# EasyEDA schematic SCH_Capstone_2024-02-12.json
TITLE: Sheet_1; REV: 1.0; Date: 2024-02-11; Sheet: 1/1; Company: Your Company
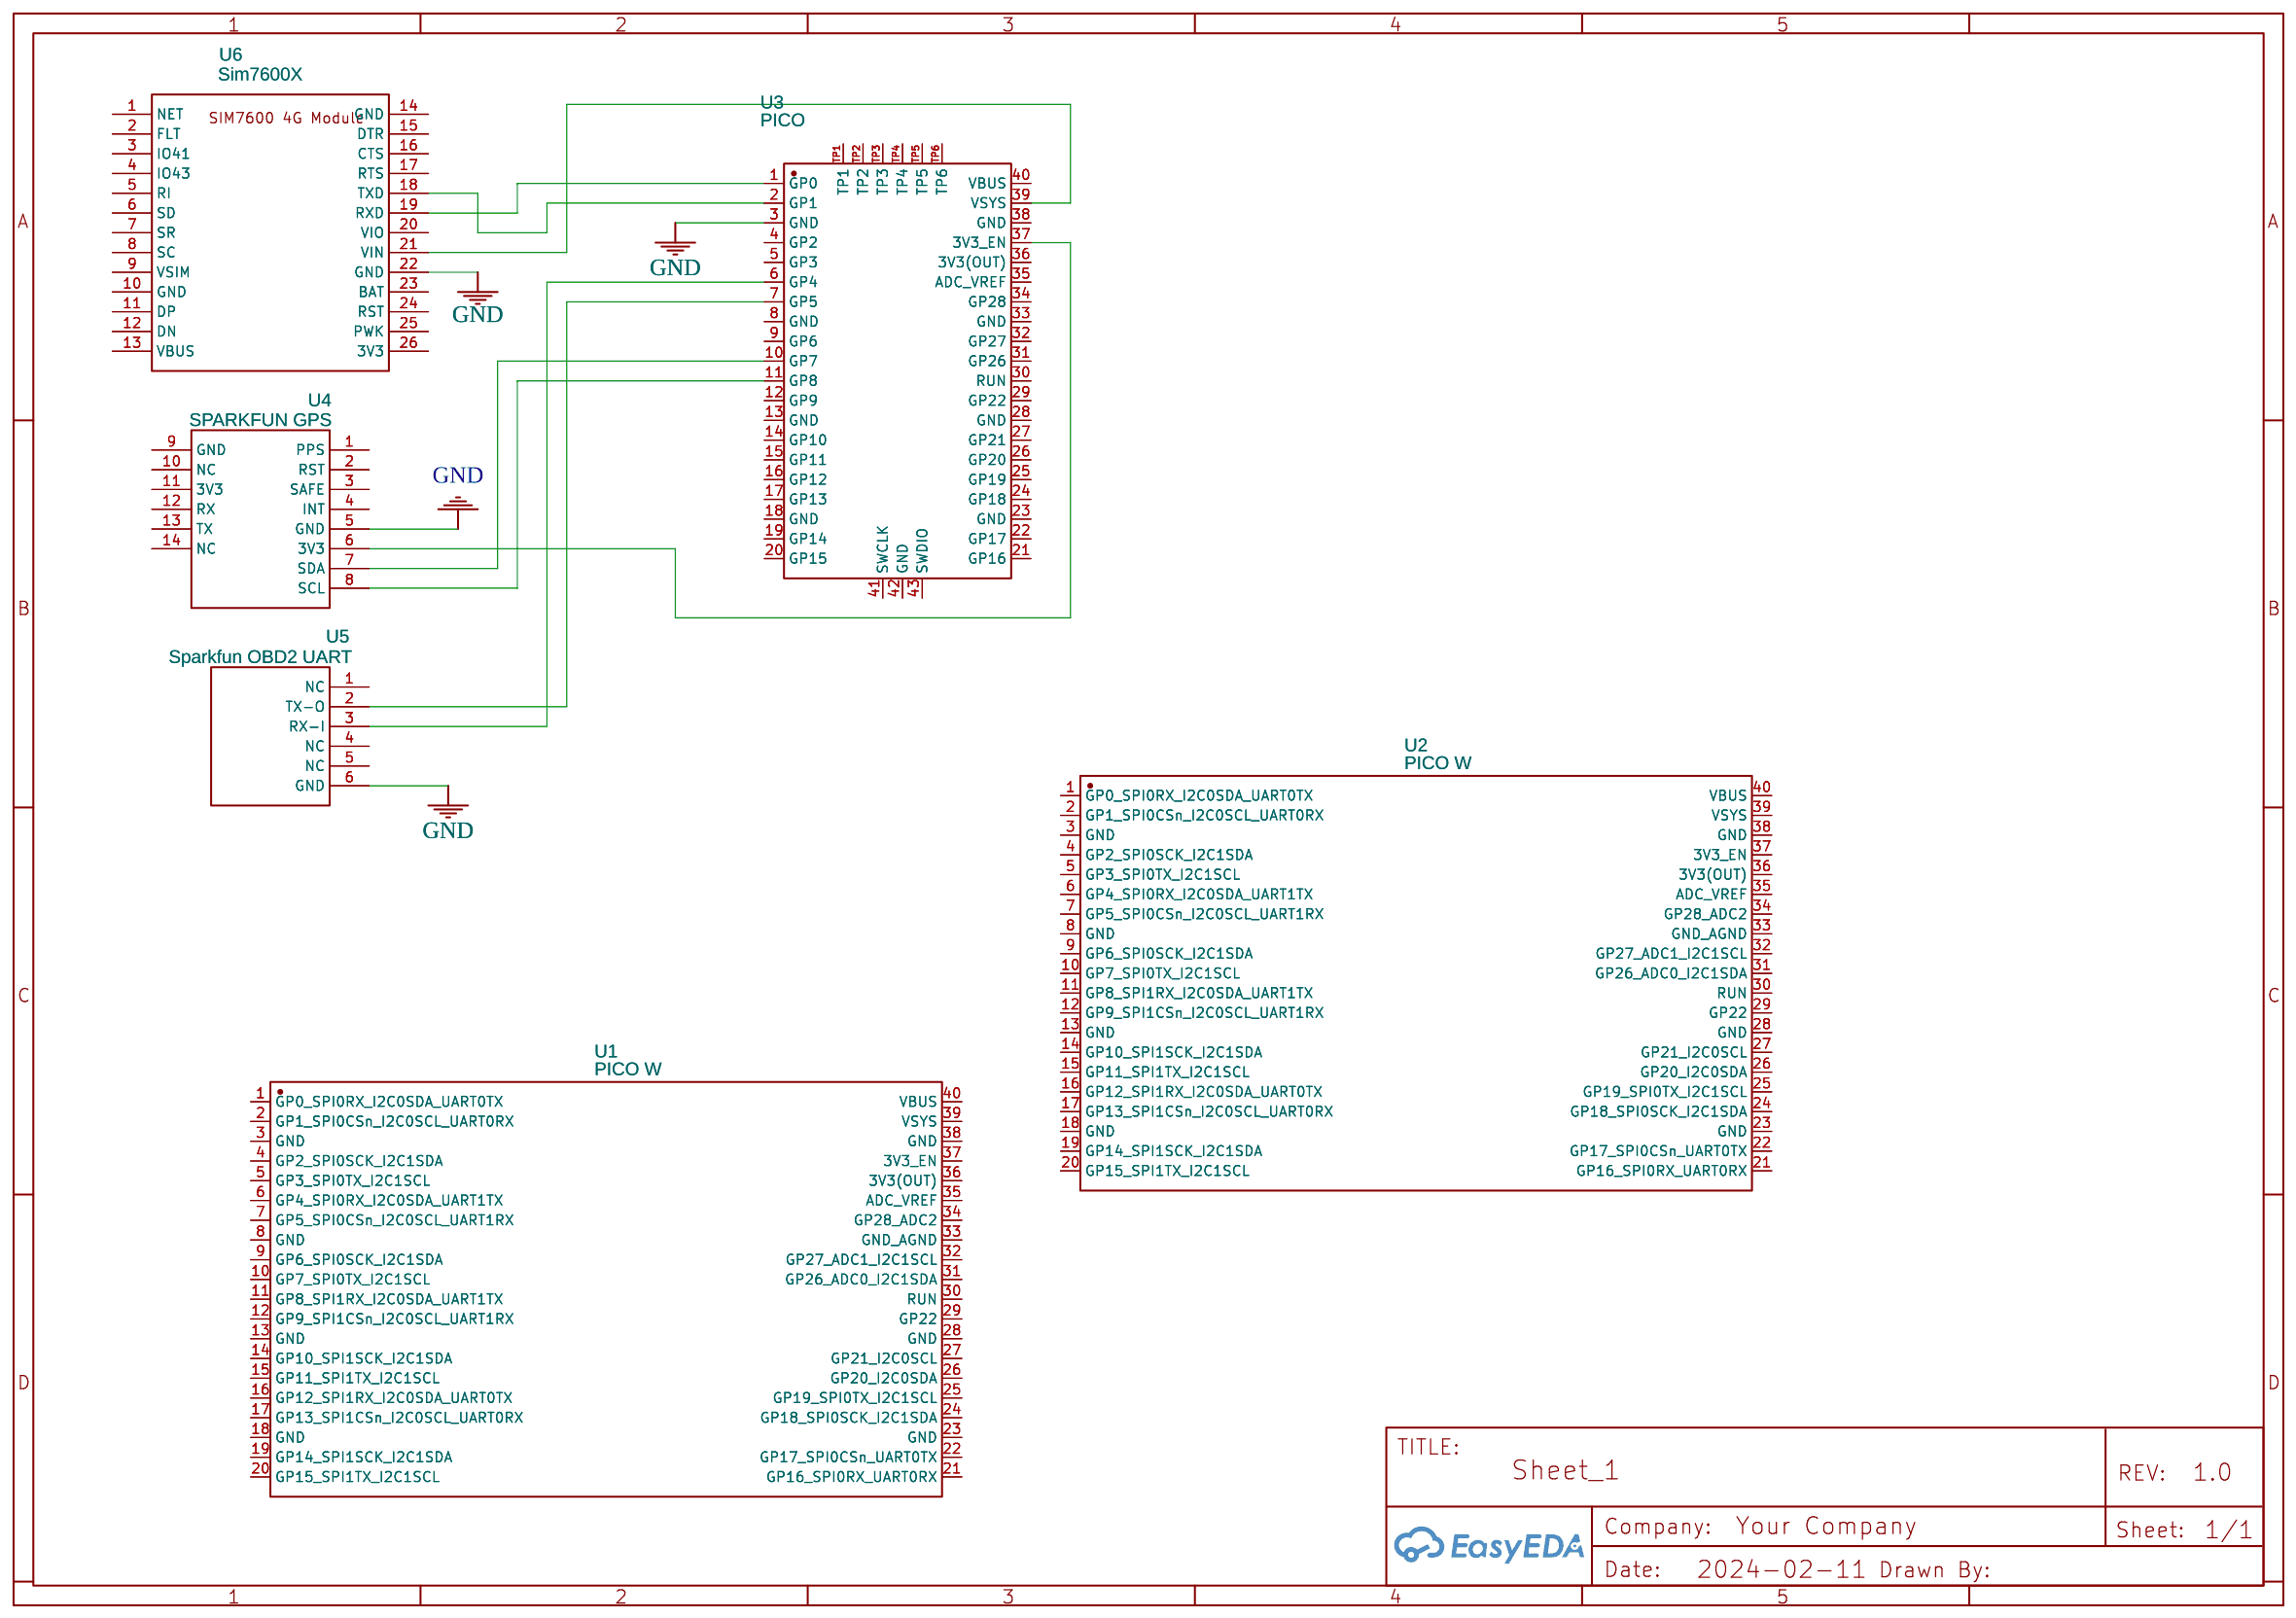
[diagram p0: schematic sheet]

## Parts
U1  PICO W  [LCC-40_L51.0-W21.0-P2.54-BL_RP2040-BASED]
U2  PICO W  [LCC-40_L51.0-W21.0-P2.54-BL_RP2040-BASED]
U3  PICO  [COMM-SMD_L51.0-W21.0-P2.54_SC0916]
U4  SPARKFUN GPS  [SPARKFUN GPS]
U5  Sparkfun OBD2 UART  [SPARKFUN OBD2 UART]
U6  Sim7600X  [SIM7600X]

## Library data of the parts
U1 U2 = PICO W: Supplier: LCSC; Supplier Part: C7203003; Manufacturer: Raspberry Pi(树莓派); Contributor: lcsc; JLCPCB Part Class: Extended Part
U3 = PICO: Supplier: LCSC; Supplier Part: C7203002; Manufacturer: Raspberry Pi(树莓派); JLCPCB Part Class: Extended Part; Contributor: lcsc
U4 = SPARKFUN GPS: Supplier: Sparkfun; Supplier Part: SAM-M8Q; link: https://www.sparkfun.com/products/15210; Contributor: unseatingsarmad
U5 = Sparkfun OBD2 UART: Supplier: Sparkfun; link: https://www.sparkfun.com/products/9555; Contributor: unseatingsarmad
U6 = Sim7600X: Supplier: Waveshare; link: https://www.waveshare.com/sim7600g-h-4g-module.htm; Contributor: Guest

## Nets
GND: U3.3(GND) U4.5(GND) U5.6(GND) U6.22(GND)
Net-(U3-1): U3.1(GP0) U6.19(RXD)
Net-(U3-2): U3.2(GP1) U6.18(TXD)
Net-(U3-6): U3.6(GP4) U5.3(RX-I)
Net-(U3-7): U3.7(GP5) U5.2(TX-O)
Net-(U3-10): U3.10(GP7) U4.7(SDA)
Net-(U3-11): U3.11(GP8) U4.8(SCL)
Net-(U3-37): U3.37(3V3_EN) U4.6(3V3)
Net-(U3-39): U3.39(VSYS) U6.21(VIN)

Not connected (* = marked no-connect by the designer): U1 1(GP0_SPI0RX_I2C0SDA_UART0TX) 2(GP1_SPI0CSn_I2C0SCL_UART0RX) 3(GND) 4(GP2_SPI0SCK_I2C1SDA) 5(GP3_SPI0TX_I2C1SCL) 6(GP4_SPI0RX_I2C0SDA_UART1TX) 7(GP5_SPI0CSn_I2C0SCL_UART1RX) 8(GND) 9(GP6_SPI0SCK_I2C1SDA) 10(GP7_SPI0TX_I2C1SCL) 11(GP8_SPI1RX_I2C0SDA_UART1TX) 12(GP9_SPI1CSn_I2C0SCL_UART1RX) 13(GND) 14(GP10_SPI1SCK_I2C1SDA) 15(GP11_SPI1TX_I2C1SCL) 16(GP12_SPI1RX_I2C0SDA_UART0TX) 17(GP13_SPI1CSn_I2C0SCL_UART0RX) 18(GND) 19(GP14_SPI1SCK_I2C1SDA) 20(GP15_SPI1TX_I2C1SCL) 21(GP16_SPI0RX_UART0RX) 22(GP17_SPI0CSn_UART0TX) 23(GND) 24(GP18_SPI0SCK_I2C1SDA) 25(GP19_SPI0TX_I2C1SCL) 26(GP20_I2C0SDA) 27(GP21_I2C0SCL) 28(GND) 29(GP22) 30(RUN) 31(GP26_ADC0_I2C1SDA) 32(GP27_ADC1_I2C1SCL) 33(GND_AGND) 34(GP28_ADC2) 35(ADC_VREF) 36(3V3(OUT)) 37(3V3_EN) 38(GND) 39(VSYS) 40(VBUS); U2 1(GP0_SPI0RX_I2C0SDA_UART0TX) 2(GP1_SPI0CSn_I2C0SCL_UART0RX) 3(GND) 4(GP2_SPI0SCK_I2C1SDA) 5(GP3_SPI0TX_I2C1SCL) 6(GP4_SPI0RX_I2C0SDA_UART1TX) 7(GP5_SPI0CSn_I2C0SCL_UART1RX) 8(GND) 9(GP6_SPI0SCK_I2C1SDA) 10(GP7_SPI0TX_I2C1SCL) 11(GP8_SPI1RX_I2C0SDA_UART1TX) 12(GP9_SPI1CSn_I2C0SCL_UART1RX) 13(GND) 14(GP10_SPI1SCK_I2C1SDA) 15(GP11_SPI1TX_I2C1SCL) 16(GP12_SPI1RX_I2C0SDA_UART0TX) 17(GP13_SPI1CSn_I2C0SCL_UART0RX) 18(GND) 19(GP14_SPI1SCK_I2C1SDA) 20(GP15_SPI1TX_I2C1SCL) 21(GP16_SPI0RX_UART0RX) 22(GP17_SPI0CSn_UART0TX) 23(GND) 24(GP18_SPI0SCK_I2C1SDA) 25(GP19_SPI0TX_I2C1SCL) 26(GP20_I2C0SDA) 27(GP21_I2C0SCL) 28(GND) 29(GP22) 30(RUN) 31(GP26_ADC0_I2C1SDA) 32(GP27_ADC1_I2C1SCL) 33(GND_AGND) 34(GP28_ADC2) 35(ADC_VREF) 36(3V3(OUT)) 37(3V3_EN) 38(GND) 39(VSYS) 40(VBUS); U3 4(GP2) 5(GP3) 8(GND) 9(GP6) 12(GP9) 13(GND) 14(GP10) 15(GP11) 16(GP12) 17(GP13) 18(GND) 19(GP14) 20(GP15) 21(GP16) 22(GP17) 23(GND) 24(GP18) 25(GP19) 26(GP20) 27(GP21) 28(GND) 29(GP22) 30(RUN) 31(GP26) 32(GP27) 33(GND) 34(GP28) 35(ADC_VREF) 36(3V3(OUT)) 38(GND) 40(VBUS) 41(SWCLK) 42(GND) 43(SWDIO) TP1 TP2 TP3 TP4 TP5 TP6; U4 1(PPS) 2(RST) 3(SAFE) 4(INT) 9(GND) 10(NC) 11(3V3) 12(RX) 13(TX) 14(NC); U5 1(NC) 4(NC) 5(NC); U6 1(NET) 2(FLT) 3(IO41) 4(IO43) 5(RI) 6(SD) 7(SR) 8(SC) 9(VSIM) 10(GND) 11(DP) 12(DN) 13(VBUS) 14(GND) 15(DTR) 16(CTS) 17(RTS) 20(VIO) 23(BAT) 24(RST) 25(PWK) 26(3V3)
